# Altium schematic sheet Controle.SchDoc
size A2; SheetNumber: 1; SheetTotal: 4
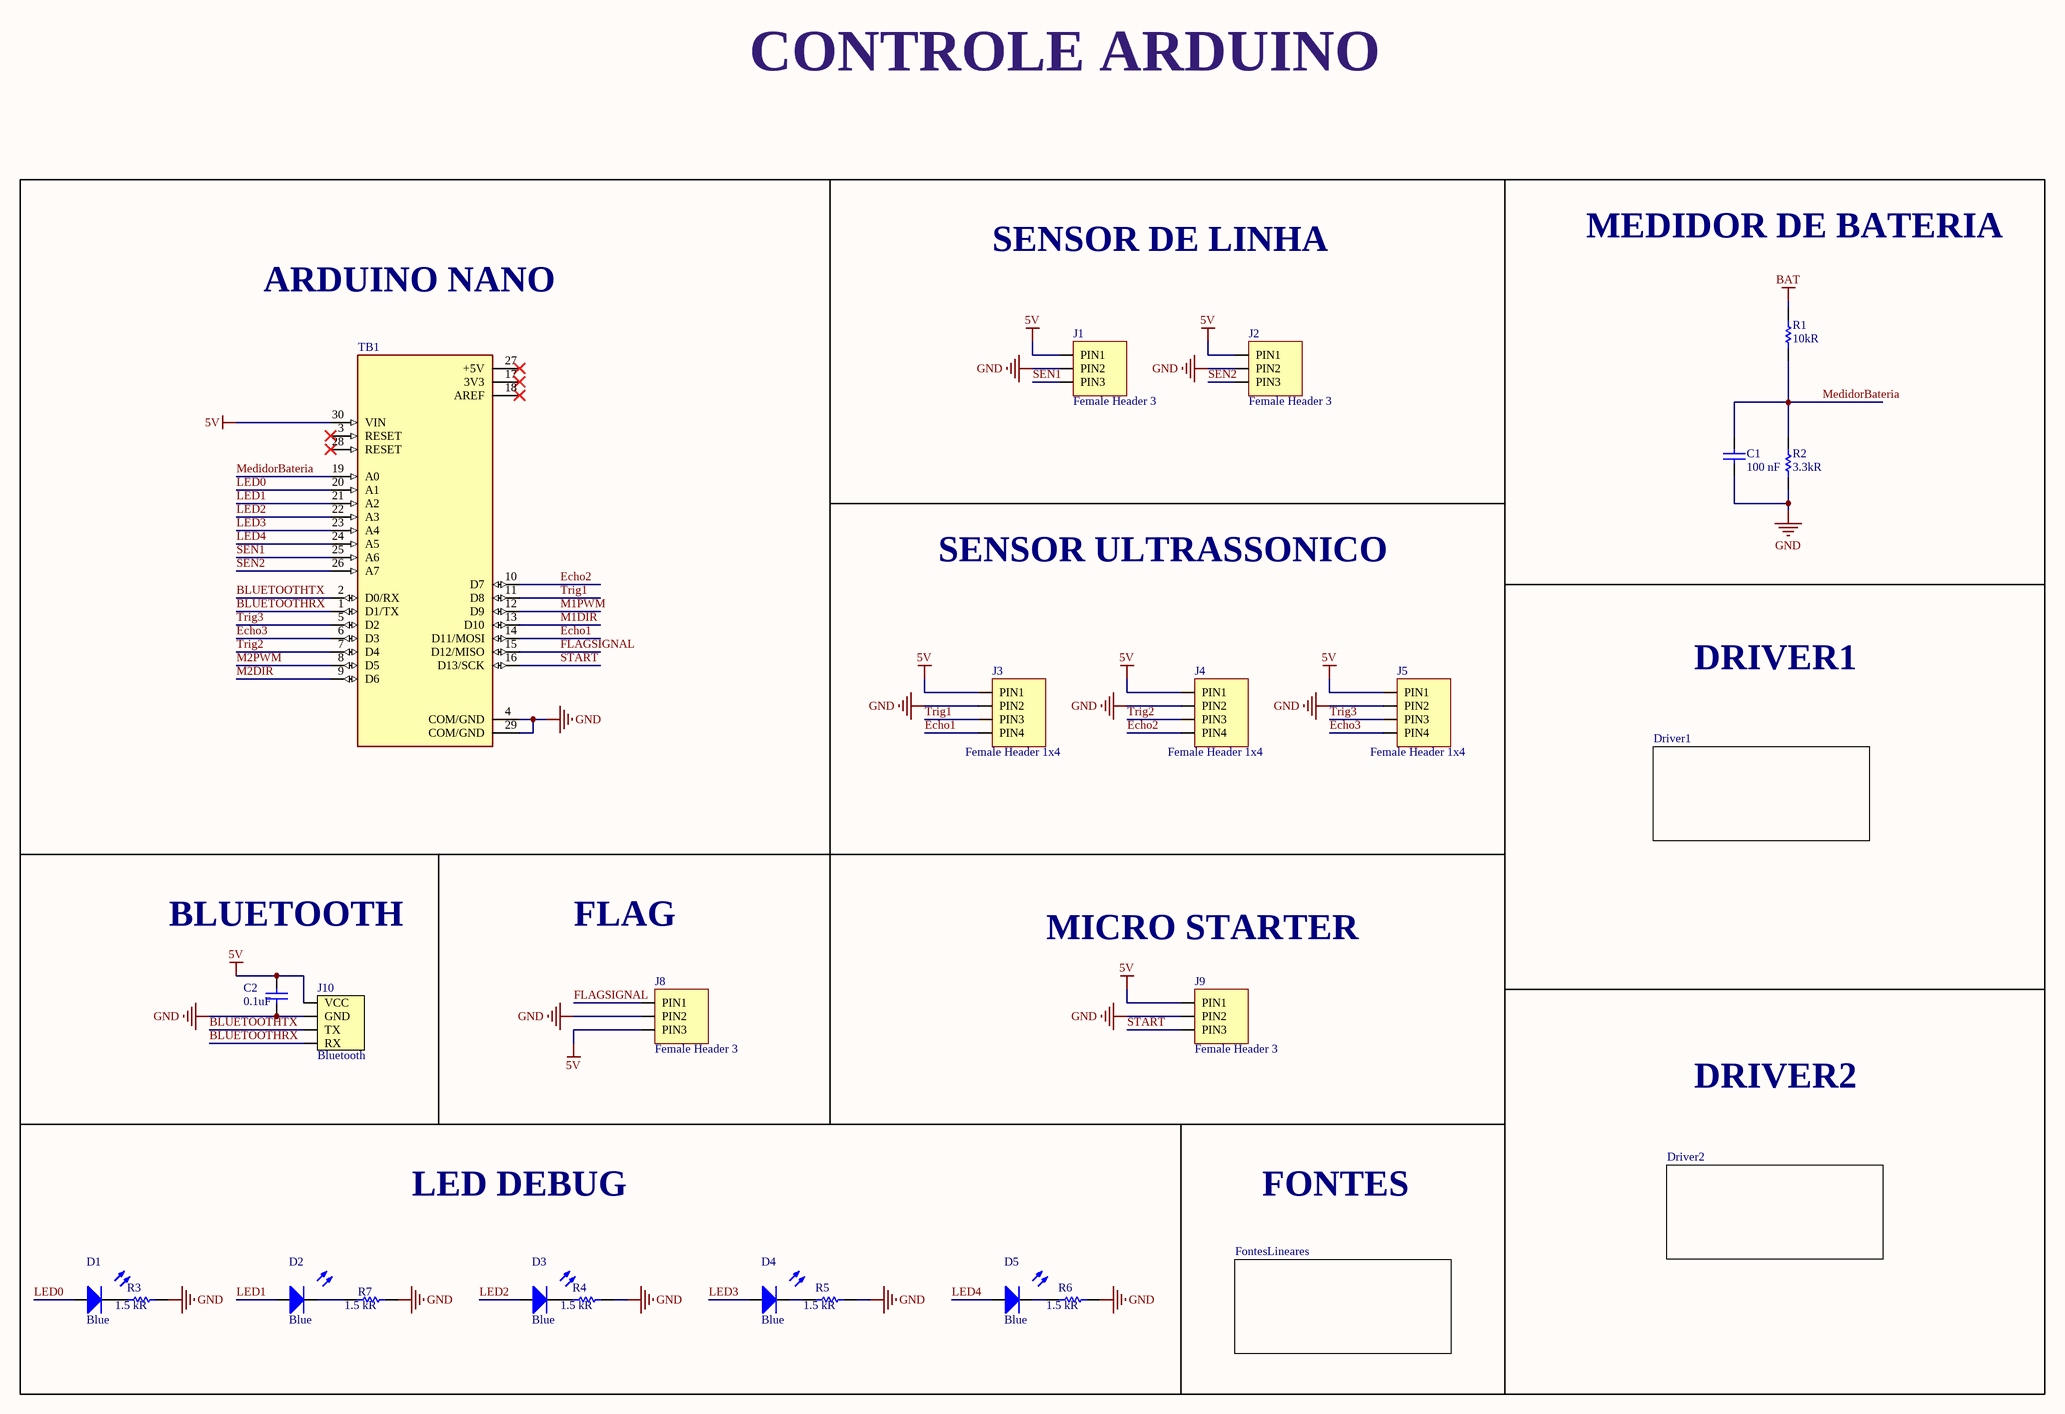
[diagram p0: Controle.SchDoc]

## Parts
C1  100 nF  [C0805]
C2  0.1uF  [C0805]
D1  Blue  [DIODO_2-SMD-3215]
D2  Blue  [DIODO_2-SMD-3215]
D3  Blue  [DIODO_2-SMD-3215]
D4  Blue  [DIODO_2-SMD-3215]
D5  Blue  [DIODO_2-SMD-3215]
J1  Female Header 3  [FEMALE HEADER 3]
J2  Female Header 3  [FEMALE HEADER 3]
J3  Female Header 1x4  [Female Header 1x4]
J4  Female Header 1x4  [Female Header 1x4]
J5  Female Header 1x4  [Female Header 1x4]
J8  Female Header 3  [FEMALE HEADER 3]
J9  Female Header 3  [FEMALE HEADER 3]
J10  Bluetooth  [BLUETOOTH]
R1  10kR  [RESISTOR_0603]
R2  3.3kR  [RESISTOR_0603]
R3  1.5 kR  [RESISTOR_0805]
R4  1.5 kR  [RESISTOR_0805]
R5  1.5 kR  [RESISTOR_0805]
R6  1.5 kR  [RESISTOR_0805]
R7  1.5 kR  [RESISTOR_0805]
TB1  (no value)  [SHIELD_ARDUINO_NANO]

## Sub-sheets
FontesLineares = FontesLineares: no entries
FontesLineares = Driver1: no entries
FontesLineares = Driver2: no entries

## Nets
5V: C2.2 J1.PIN1 J2.PIN1 J3.PIN1 J4.PIN1 J5.PIN1 J8.PIN3 J9.PIN1 J10.VCC TB1.30(VIN)
BAT: R1.2
GND: C1.1 C2.1 J1.PIN2 J2.PIN2 J3.PIN2 J4.PIN2 J5.PIN2 J8.PIN2 J9.PIN2 J10.GND R2.1 R3.2 R4.2 R5.2 R6.2 R7.2 TB1.4(COM/GND) TB1.29(COM/GND)
BLUETOOTHRX: J10.RX TB1.1(D1/TX)
BLUETOOTHTX: J10.TX TB1.2(D0/RX)
Echo1: J3.PIN4 TB1.14(D11/MOSI)
Echo2: J4.PIN4 TB1.10(D7)
Echo3: J5.PIN4 TB1.6(D3)
FLAGSIGNAL: J8.PIN1 TB1.15(D12/MISO)
LED0: D1.A TB1.20(A1)
LED1: D2.A TB1.21(A2)
LED2: D3.A TB1.22(A3)
LED3: D4.A TB1.23(A4)
LED4: D5.A TB1.24(A5)
M1DIR: TB1.13(D10)
M1PWM: TB1.12(D9)
M2DIR: TB1.9(D6)
M2PWM: TB1.8(D5)
MedidorBateria: C1.2 R1.1 R2.2 TB1.19(A0)
SEN1: J1.PIN3 TB1.25(A6)
SEN2: J2.PIN3 TB1.26(A7)
START: J9.PIN3 TB1.16(D13/SCK)
Trig1: J3.PIN3 TB1.11(D8)
Trig2: J4.PIN3 TB1.7(D4)
Trig3: J5.PIN3 TB1.5(D2)
NetD1_C: D1.C R3.1
NetD2_C: D2.C R7.1
NetD3_C: D3.C R4.1
NetD4_C: D4.C R5.1
NetD5_C: D5.C R6.1

Not connected (* = marked no-connect by the designer): TB1 3(RESET)* 17(3V3)* 18(AREF)* 27(+5V)* 28(RESET)*

## Notes on the sheet
- CONTROLE ARDUINO
- MEDIDOR DE BATERIA
- ARDUINO NANO
- SENSOR DE LINHA
- SENSOR ULTRASSONICO
- DRIVER1
- BLUETOOTH
- FLAG
- MICRO STARTER
- DRIVER2
- LED DEBUG
- FONTES

## Library data of the parts
C1 = 885012207128: CAP CER 100 nF 100V X7R 0805; Manufacturer: Wurth Elektronik; Tolerance: 10%; Voltage - Rated: 100 VDC; Library Control - Checked Footprint: Yes; Supplier 1: Mouser; Part Number: 885012207128; Category: Ceramic capacitor; Price: 1=0,41 10=0,283 100=0,169 1000=0,107 (USD); Supplier Part Number 1: 710-885012207128; Library Ref: Capacitor; Operating Temperature: -55°C ~125ºC; Package / Case: 0805(2012 Metric); Size / Dimension: 2 mm L  x 1.25 mm W x 1.25 mm H; Value: 100 nF; ESR: -; Dieletric: X7R; Library Control - Checked Schematic: Yes; ComponentLink1Description: Datasheet; ComponentLink1URL: https://br.mouser.com/datasheet/2/445/885012207128-1727772.pdf; ComponentLink2Description: Mouser Link; ComponentLink2URL: https://br.mouser.com/ProductDetail/Wurth-Elektronik/885012207128?qs=MLItCLRbWsys1TnbPEYt%252BQ%3D%3D
C2 = C0805C104M3RACTU: CAP CER 0.1uF 25V X7R 0805; Manufacturer: Kemet; Tolerance: 20%; Voltage - Rated: 25 VDC; Library Control - Checked Footprint: No; Library Control - Checked Schematic: Yes; Library Control - Person that Checked Schematic: Guilherme; Library Control - Person that did the Last Update Schematic: Marcos; Supplier 1: Mouser; Part Number: C0805C104M3RACTU; Category: Ceramic Capacitor; Price: 1=0,13 10=0,064 100=0,037 1000=0,025 (USD); Supplier Part Number 1: 80-C0805C104M3R; Library Ref: Capacitor; Operating Temperature: -55 C ~ 125 C; Package / Case: 0805(2012 mestric); Size / Dimension: 1.25 mm W x 2 mm L x 0.78 mm H; Value: 0.1uF; ESR: -; Dieletric: X7R; Library Control - Last Update: 26/06/2021 20:52; ComponentLink1Description: Datasheet; ComponentLink1URL: https://br.mouser.com/datasheet/2/212/KEM_C1002_X7R_SMD-1102033.pdf; ComponentLink2Description: Mouser Link; ComponentLink2URL: https://br.mouser.com/ProductDetail/KEMET/C0805C104M3RACTU?qs=jbCUrP3sAgSIdMuvv9W4Pg%3D%3D
D1-D5 = EAST3215BA5: LED 75mW BLUE 45MCD 3215; Manufacturer: Everlight Electronics; Current - Forward (If): 20 mA; Voltage - Forward (Vf): 3,30 V; Viewing Angle: 130°; Wavelength: 468 nm; Reverse Voltage: 5 V; Library Control - Checked Footprint: yes; Library Control - Person that Checked Footprint: Lucas; Library Control - Person that did the Last Update Footprint: Stéfany (Ster); Supplier 1: Mouser; Part Number: EAST3215BA5; Category: Standard LEDs - SMD; Price: 1 = 0,3800, 10 = 0,2050, 100 = 0.1080 (USD); Package / Case: 3215; Color: Blue; Operating Temperature: - 40 °C ~ 85 °C; Luminous Intensity: 45 mcd; Library Ref: Diodo/Led; Supplier Part Number 1: 638-EAST3215BA5; Max Power Dissipation: 75 mW; Max Current Rating: 20 mA; Library Control - Checked Schematic: yes; Library Control - Last Update: 13/06/2021 12:45; Library Control - Person that Checked Schematic: Lucas; Library Control - Person that did the Last Update Schematic: Stéfany (Ster); ComponentLink1Description: Mouser Link; ComponentLink1URL: https://www.mouser.com/ProductDetail/Everlight/EAST3215BA5?qs=Cqqh%252BS766wnzp9nQVj5A4g==; ComponentLink2Description: Datasheet; ComponentLink2URL: https://www.mouser.com/datasheet/2/143/EAST3215BA5-1154292.pdf
J1 J2 J8 J9 = Female Header 3: Number of Contacts: 3; System: Connector; Library Ref: Header
J10 = Barramento Bluetooth: BARRAMENTO BLUETOOTH HC-06; Number of Contacts: 4; Bluetooth Mode: Slave Only; Operating Voltage: 3,6 / 6 (V); Max Range: 10m; Frequency: 2,4 GHz; Modulation: GFSK (Gaussian Frequency Shift Keying); Recomended Operating Configuration: 5V @ 50mA; Maximum Serial Transmission Rate: 9600 bps; Library Ref: Header
R1 = RC0603JR-0710KL: RES SMD 10K OHM 5% 1/10W 0603; Manufacturer: Yageo; Temperature Coefficient: 100 PPM / C; Power Rating: 100 mW (1/10 W); Voltage Rating: 75 V; Library Control - Checked Footprint: No; Library Control - Checked Schematic: Yes; Library Control - Person that Checked Schematic: Marcos; Library Control - Person that did the Last Update Footprint: Dalarme; Supplier 1: Mouser; Part Number: RC0603JR-0710KL; Category: Thick Film Resistors - SMD; Price: 1=0,10, 10=0,015, 100=0,005 1000=0,0040 (USD); Package / Case: 0603 (1608 Metric); Operating Temperature: - 55ºC ~ 155ºC; Value: 10kR; Tolerance: 5 %; Library Ref: Resistor; Resistor Type: Fixo; Size / Dimension: 1.6 mm L x  0.8 mm W x  0.45 mm H; Supplier Part Number 1: 603-RC0603JR-0710KL; Library Control - Last Update: 21/06/21 14:15; Library Control - Person that did the Last Update Schematic: Marcos; ComponentLink1Description: Mouser Link; ComponentLink1URL: https://br.mouser.com/ProductDetail/Yageo/RC0603JR-0710KL?qs=ksOUTF%2FWcd8D6T22BJkQ7g%3D%3D; ComponentLink2Description: Datsheet Link; ComponentLink2URL: https://br.mouser.com/datasheet/2/447/Yageo_03_18_2021_PYu_RC_Group_51_RoHS_L_11-2199992.pdf
R2 = CRGCQ0603F3K3: RES SMD 3.3K OHM 1% 1/10W 0603; Manufacturer: TE Connectivity / Holsworthy; Temperature Coefficient: 100 PPM / C; Power Rating: 100 mW (1/10 W); Voltage Rating: 75 V; Library Control - Checked Footprint: Yes; Library Control - Person that Checked Footprint: Nikaum; Library Control - Person that Checked Schematic: Guilherme; Library Control - Person that did the Last Update Footprint: Dalarme; Supplier 1: Mouser; Part Number: CRGCQ0603F3K3; Category: Thick Film Resistors; Price: 1=0,10, 10=0,029, 100=0,011 (USD); Package / Case: 0603 (1608 Metric); Operating Temperature: - 55ºC ~ 125ºC; Value: 3.3kR; Tolerance: 1 %; Library Ref: Resistor; Resistor Type: Fixed; Size / Dimension: 1.6 mm L x  0.8 mm W x  0.45 mm H; Supplier Part Number 1: 279-CRGCQ0603F3K3; Library Control - Checked Schematic: Yes; Library Control - Last Update: 27/06/2021 20:27; Library Control - Person that did the Last Update Schematic: Dalarme; ComponentLink1Description: Mouser Link; ComponentLink1URL: https://br.mouser.com/ProductDetail/TE-Connectivity-Holsworthy/CRGCQ0603F3K3?qs=sGAEpiMZZMvdGkrng054t7z4BkURc4Lz7mzhBruKq8fwVJ16OlxZFQ%3D%3D; ComponentLink2Description: Datasheet; ComponentLink2URL: https://br.mouser.com/datasheet/2/418/4/NG_DS_1773204-3_1-1358553.pdf
R3-R7 = CRCW08051K50FKEAC: RES SMD 1.5K OHM 1% 1/8W 0805; Manufacturer: Vishay / Dale; Temperature Coefficient: 100 PPM / C; Power Rating: 125 mW (1/8 W); Voltage Rating: 150 V; Library Control - Checked Footprint: Yes; Library Control - Person that Checked Footprint: Nikaum; Library Control - Person that did the Last Update Footprint: Nicolas; Supplier 1: Mouser; Part Number: CRCW08051K50FKEAC; Category: Thick Film Resistors - SMD; Price: 1=0,10, 10=0,059, 100=0,024 (USD); Package / Case: 0805 (2012 Metric); Operating Temperature: -55 C ~ 155 C; Value: 1.5 kR; Tolerance: 1 %; Library Ref: Resistor; Resistor Type: Fixo; Size / Dimension: 2,00 L x 1,25 W x 0,45 H; Supplier Part Number 1: 71-CRCW08051K50FKEAC; Library Control - Checked Schematic: Yes; Library Control - Last Update: 27/06/2021 20:45; Library Control - Person that Checked Schematic: Nikaum; Library Control - Person that did the Last Update Schematic: Nikaum; ComponentLink1Description: Mouser Link; ComponentLink1URL: https://br.mouser.com/ProductDetail/Vishay-Dale/CRCW08051K50FKEAC?qs=E3Y5ESvWgWMwo6R2oqPQ9Q%3D%3D; ComponentLink2Description: Datasheet; ComponentLink2URL: https://br.mouser.com/datasheet/2/427/crcwce3-1762584.pdf
TB1 = ARDUINO_NANO: Small, complete, and breadboard-friendly board based on the ATmega328 (Arduino Nano 3.x); Check_prices: https://www.snapeda.com/parts/Arduino%20Nano/Arduino/view-part/?ref=eda; Value: *; Availability: Not in stock; MP: Arduino Nano; Price: None; Package: Non-Standard Arduino; SnapEDA_Link: https://www.snapeda.com/parts/Arduino%20Nano/Arduino/view-part/?ref=snap; MF: Arduino